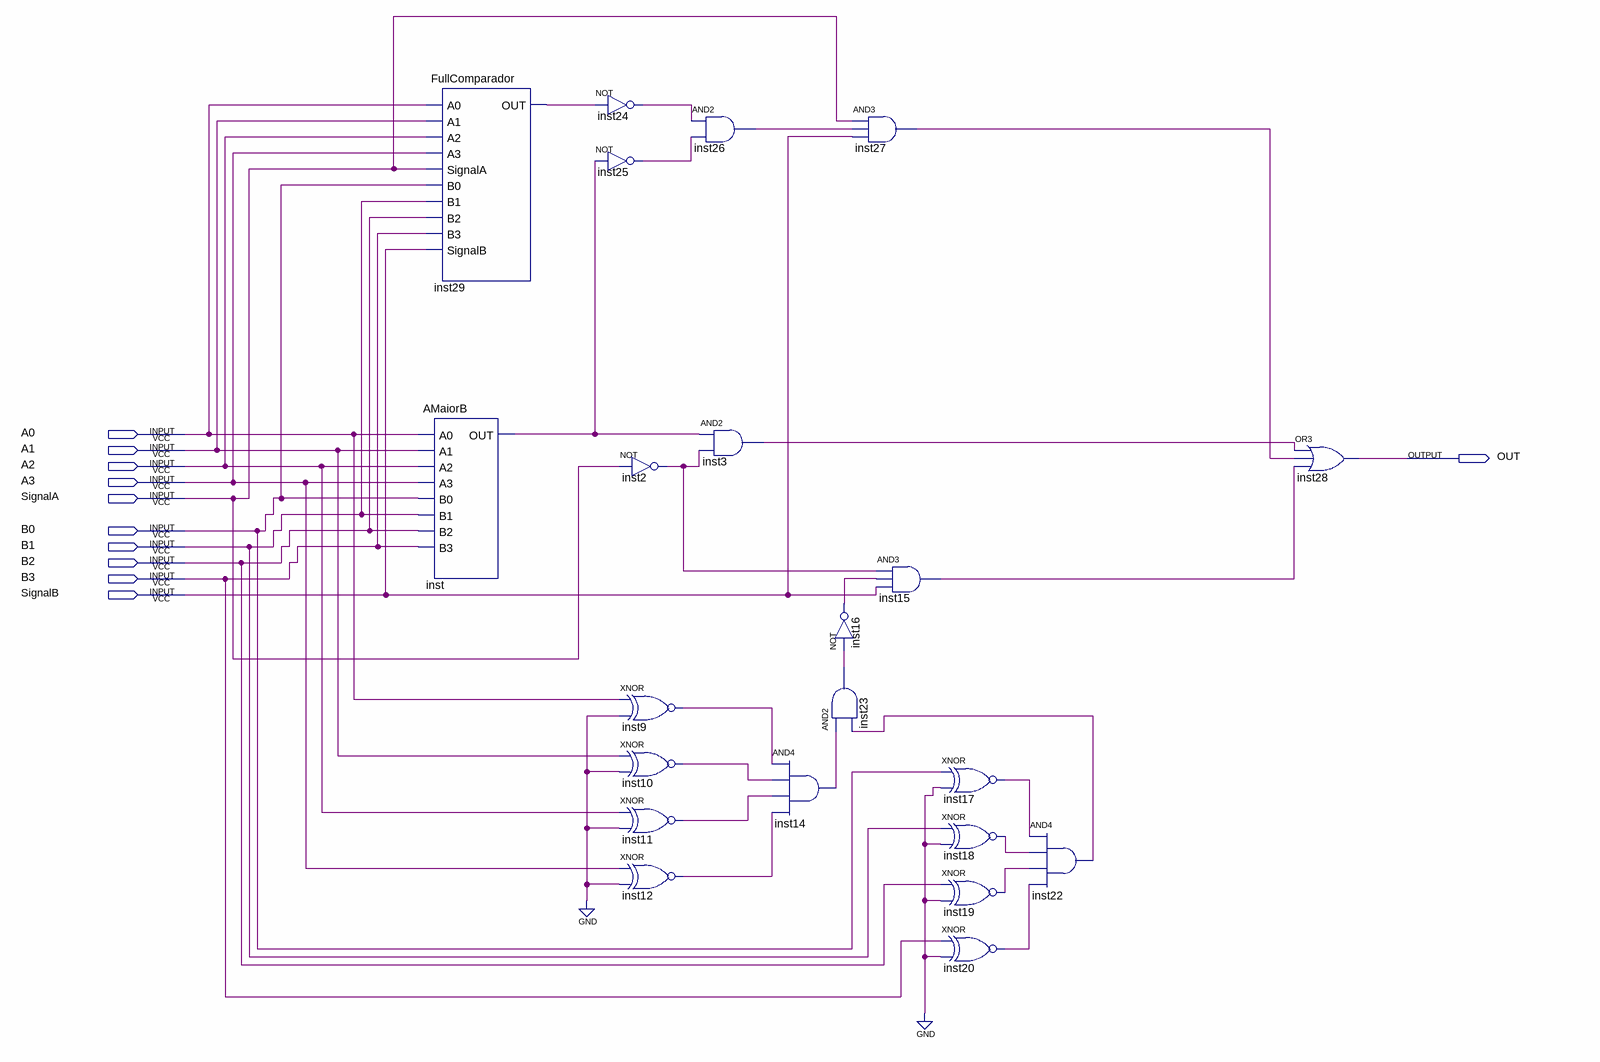
[diagram p0: schematic sheet]
// Quartus schematic ComparadaorMmCompleto.bdf as structural Verilog: 22 symbols, 11 pins
module ComparadaorMmCompleto (
  input  A0,
  input  A1,
  input  A2,
  input  A3,
  input  SignalA,
  input  B0,
  input  B1,
  input  B2,
  input  B3,
  input  SignalB,
  output OUT
);

  wire inst2_out, inst3_out, inst9_out, inst10_out, inst11_out, inst12_out, inst14_out, inst15_out,
       inst16_out, inst17_out, inst18_out, inst19_out, inst20_out, inst22_out, inst23_out, inst24_out,
       inst25_out, inst26_out, inst27_out, inst29_out, inst_out;

  FullComparador inst29 (
    .A0(A0), .A1(A1), .A2(A2), .A3(A3), .SignalA(SignalA), .B0(B0), .B1(B1), .B2(B2), .B3(B3),
    .SignalB(SignalB), .OUT(inst29_out));
  AMaiorB inst (.A0(A0), .A1(A1), .A2(A2), .A3(A3), .B0(B0), .B1(B1), .B2(B2), .B3(B3), .OUT(inst_out));
  not inst24 (inst24_out, inst29_out);
  not inst25 (inst25_out, inst_out);
  not inst2 (inst2_out, SignalA);
  xnor inst9 (inst9_out, A0, 1'b0);
  xnor inst10 (inst10_out, A1, 1'b0);
  xnor inst11 (inst11_out, A2, 1'b0);
  xnor inst12 (inst12_out, A3, 1'b0);
  and inst26 (inst26_out, inst24_out, inst25_out);
  and inst3 (inst3_out, inst_out, inst2_out);
  and inst14 (inst14_out, inst9_out, inst10_out, inst11_out, inst12_out);
  not inst16 (inst16_out, inst23_out);
  and inst23 (inst23_out, inst14_out, inst22_out);
  and inst27 (inst27_out, SignalA, inst26_out, SignalB);
  and inst15 (inst15_out, inst2_out, inst16_out, SignalB);
  xnor inst17 (inst17_out, B0, 1'b0);
  xnor inst18 (inst18_out, B1, 1'b0);
  xnor inst19 (inst19_out, B2, 1'b0);
  xnor inst20 (inst20_out, B3, 1'b0);
  and inst22 (inst22_out, inst17_out, inst18_out, inst19_out, inst20_out);
  or inst28 (OUT, inst3_out, inst27_out, inst15_out);
endmodule
